# Altium schematic sheet ButterWorth_8th_order_Filter.SchDoc
size B
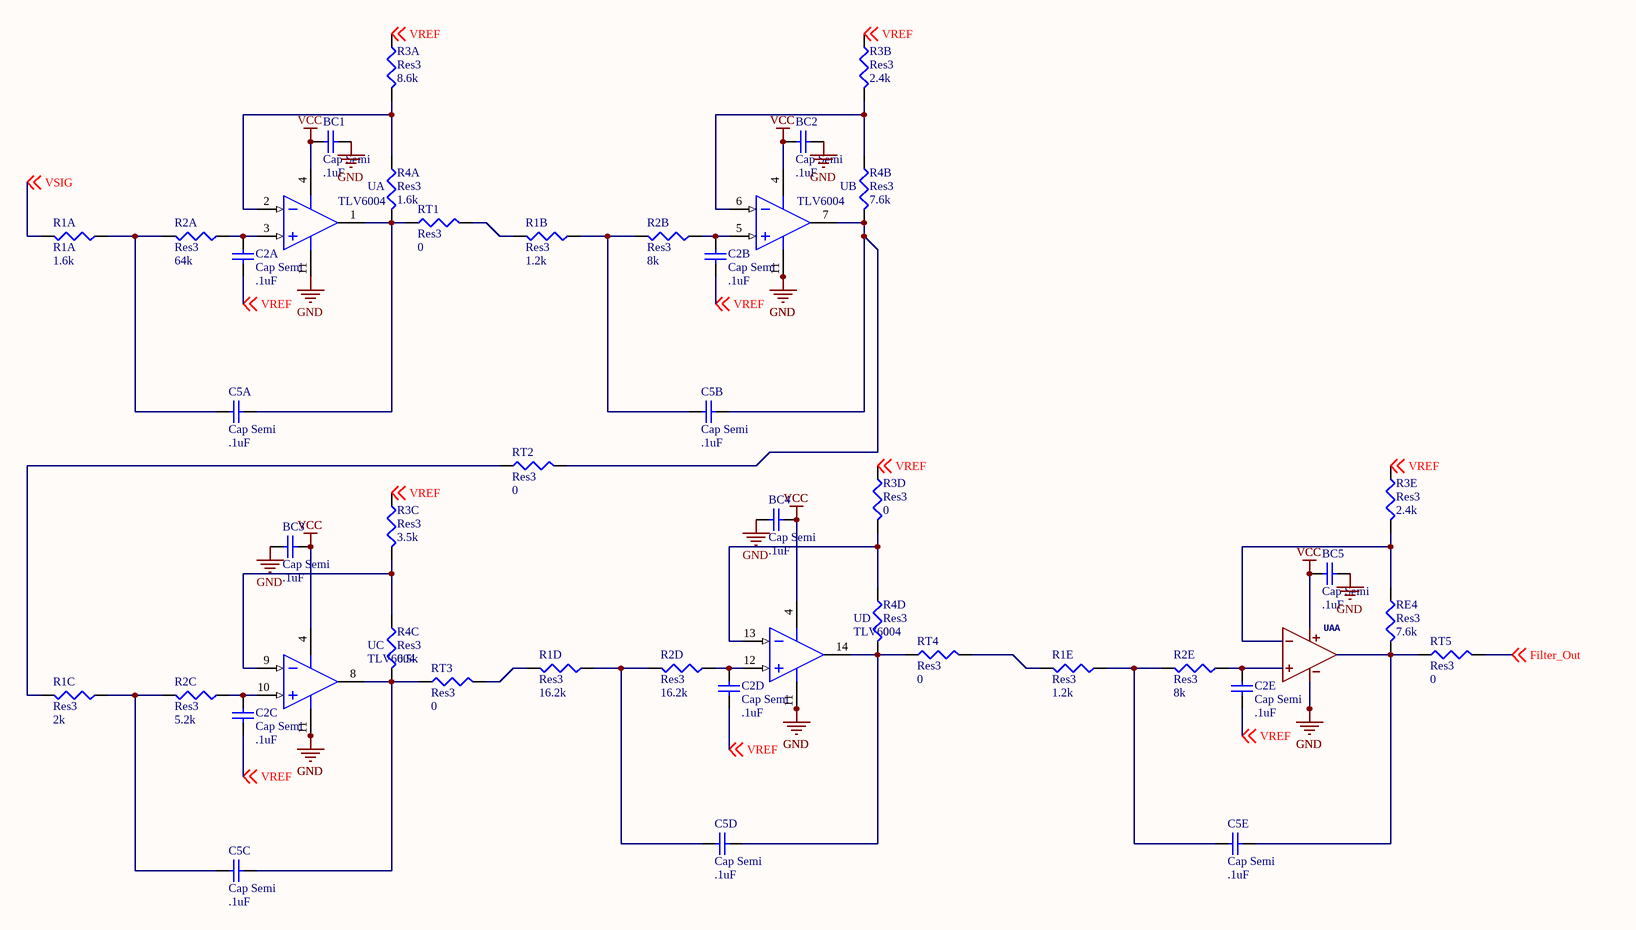
[diagram p0: ButterWorth_8th_order_Filter.SchDoc]

## Parts
BC1  Cap Semi  value .1uF  [1608[0603]]
BC2  Cap Semi  value .1uF  [1608[0603]]
BC3  Cap Semi  value .1uF  [1608[0603]]
BC4  Cap Semi  value .1uF  [1608[0603]]
BC5  Cap Semi  value .1uF  [1608[0603]]
C2A  Cap Semi  value .1uF  [1608[0603]]
C2B  Cap Semi  value .1uF  [1608[0603]]
C2C  Cap Semi  value .1uF  [1608[0603]]
C2D  Cap Semi  value .1uF  [1608[0603]]
C2E  Cap Semi  value .1uF  [1608[0603]]
C5A  Cap Semi  value .1uF  [C1206]
C5B  Cap Semi  value .1uF  [C1206]
C5C  Cap Semi  value .1uF  [C1206]
C5D  Cap Semi  value .1uF  [C1206]
C5E  Cap Semi  value .1uF  [C1206]
R1A  R1A  value 1.6k  [J1-0603]
R1B  Res3  value 1.2k  [J1-0603]
R1C  Res3  value 2k  [J1-0603]
R1D  Res3  value 16.2k  [J1-0603]
R1E  Res3  value 1.2k  [J1-0603]
R2A  Res3  value 64k  [J1-0603]
R2B  Res3  value 8k  [J1-0603]
R2C  Res3  value 5.2k  [J1-0603]
R2D  Res3  value 16.2k  [J1-0603]
R2E  Res3  value 8k  [J1-0603]
R3A  Res3  value 8.6k  [J1-0603]
R3B  Res3  value 2.4k  [J1-0603]
R3C  Res3  value 3.5k  [J1-0603]
R3D  Res3  value 0  [J1-0603]
R3E  Res3  value 2.4k  [J1-0603]
R4A  Res3  value 1.6k  [J1-0603]
R4B  Res3  value 7.6k  [J1-0603]
R4C  Res3  value 6.5k  [J1-0603]
R4D  Res3  value 0  [J1-0603]
RE4  Res3  value 7.6k  [J1-0603]
RT1  Res3  value 0  [J1-0603]
RT2  Res3  value 0  [J1-0603]
RT3  Res3  value 0  [J1-0603]
RT4  Res3  value 0  [J1-0603]
RT5  Res3  value 0  [J1-0603]
U  TLV6004  [SOP65P640X120-14N]  (parts A,B,C,D of 4)
UAA  Universal Opamp model that allows 4 different levels of simulation accuracy.  See ./examples/Educational/UniversalOpamp2.asc for details.  En and in are equivalent voltage and current noises.  Enk and ink are the respective corner frequencies.  Phimargin is used to set the 2nd pole or delay to the approximate phase margin for level.3a and level.3b.  This version uses the new, experimental level 2 switch as the output devices.  [SOT95P280X100-5N]  (value not drawn)

## Nets
GND: BC1.1 BC2.1 BC3.2 BC4.2 BC5.1 U.11(V-) UAA.2(V-)
VCC: BC1.2 BC2.2 BC3.1 BC4.1 BC5.2 U.4(V+) UAA.5(V+)
Filter_Out: RT5.1 ; off-sheet Filter_Out
VREF: C2A.1 C2B.1 C2C.1 C2D.1 C2E.1 R3A.2 R3B.2 R3C.2 R3D.2 R3E.2 ; off-sheet VREF
VSIG: R1A.1 ; off-sheet VSIG
NetC2A_2: C2A.2 R2A.2 U.3(IN+)
NetC2B_2: C2B.2 R2B.2 U.5(IN+)
NetC2C_2: C2C.2 R2C.2 U.10(IN+)
NetC2D_2: C2D.2 R2D.2 U.12(IN+)
NetC2E_2: C2E.2 R2E.2 UAA.3(IN+)
NetC5A_1: C5A.1 R4A.1 RT1.2 U.1(OUT)
NetC5A_2: C5A.2 R1A.2 R2A.1
NetC5B_1: C5B.1 R4B.1 RT2.1 U.7(OUT)
NetC5B_2: C5B.2 R1B.2 R2B.1
NetC5C_1: C5C.1 R4C.1 RT3.2 U.8(OUT)
NetC5C_2: C5C.2 R1C.2 R2C.1
NetC5D_1: C5D.1 R4D.1 RT4.2 U.14(OUT)
NetC5D_2: C5D.2 R1D.2 R2D.1
NetC5E_1: C5E.1 RE4.1 RT5.2 UAA.1(OUT)
NetC5E_2: C5E.2 R1E.2 R2E.1
NetR1B_1: R1B.1 RT1.1
NetR1C_1: R1C.1 RT2.2
NetR1D_1: R1D.1 RT3.1
NetR1E_1: R1E.1 RT4.1
NetR3A_1: R3A.1 R4A.2 U.2(IN-)
NetR3B_1: R3B.1 R4B.2 U.6(IN-)
NetR3C_1: R3C.1 R4C.2 U.9(IN-)
NetR3D_1: R3D.1 R4D.2 U.13(IN-)
NetR3E_1: R3E.1 RE4.2 UAA.4(IN-)

## Library data of the parts
BC1-BC5 C2A C2B C2C C2D C2E C5A C5B C5C C5D C5E = Cap Semi: Capacitor (Semiconductor SIM Model); Published: 8-Jun-2000; LatestRevisionDate: 29-May-2009; LatestRevisionNote: IPC-7351 Footprint Added.; PackageReference: C1206; Publisher: Altium Limited; PackageDescription: Chip Capacitor
R1A R1B R1C R1D R1E R2A R2B R2C R2D R2E R3A R3B R3C R3D R3E R4A R4B R4C R4D RE4 RT1-RT5 = Res3: Resistor; Published: 8-Jun-2000; LatestRevisionDate: 29-May-2009; LatestRevisionNote: IPC-7351 Footprint Added.; PackageReference: J1-0603; Publisher: Altium Limited; PackageDescription: Chip Resistor
U = LP2901D: Low Power Quad Differential Comparator; Published: 16-Jan-2001; LatestRevisionDate: 13-Apr-2006; LatestRevisionNote: IPC-7351 Footprint Added.; DatasheetVersion: May-1988; PackageVersion: Jan-1998; PackageReference: D014; Publisher: Altium Limited; PackageDescription: 14-Pin Small Outline Integrated Circuit 1.27 mm Pitch; Code_IPC: SOIC127P600-14; ComponentLink1Description: Manufacturer Link; ComponentLink1URL: http://www.ti.com/; ComponentLink2Description: Datasheet; ComponentLink2URL: http://www-s.ti.com/sc/ds/lp2901.pdf
UAA = UNIVERSALOPAMP2: GateName_1: G$1; SymbolName_1: UNIVERSALOPAMP2; LibraryName: Opamps; DeviceSetName: UNIVERSALOPAMP2; Package: S8